# EAGLE design PCB-CMB-5-SKAARDUINO (EAGLE 7.1.0)

## Sheet 1 of 2
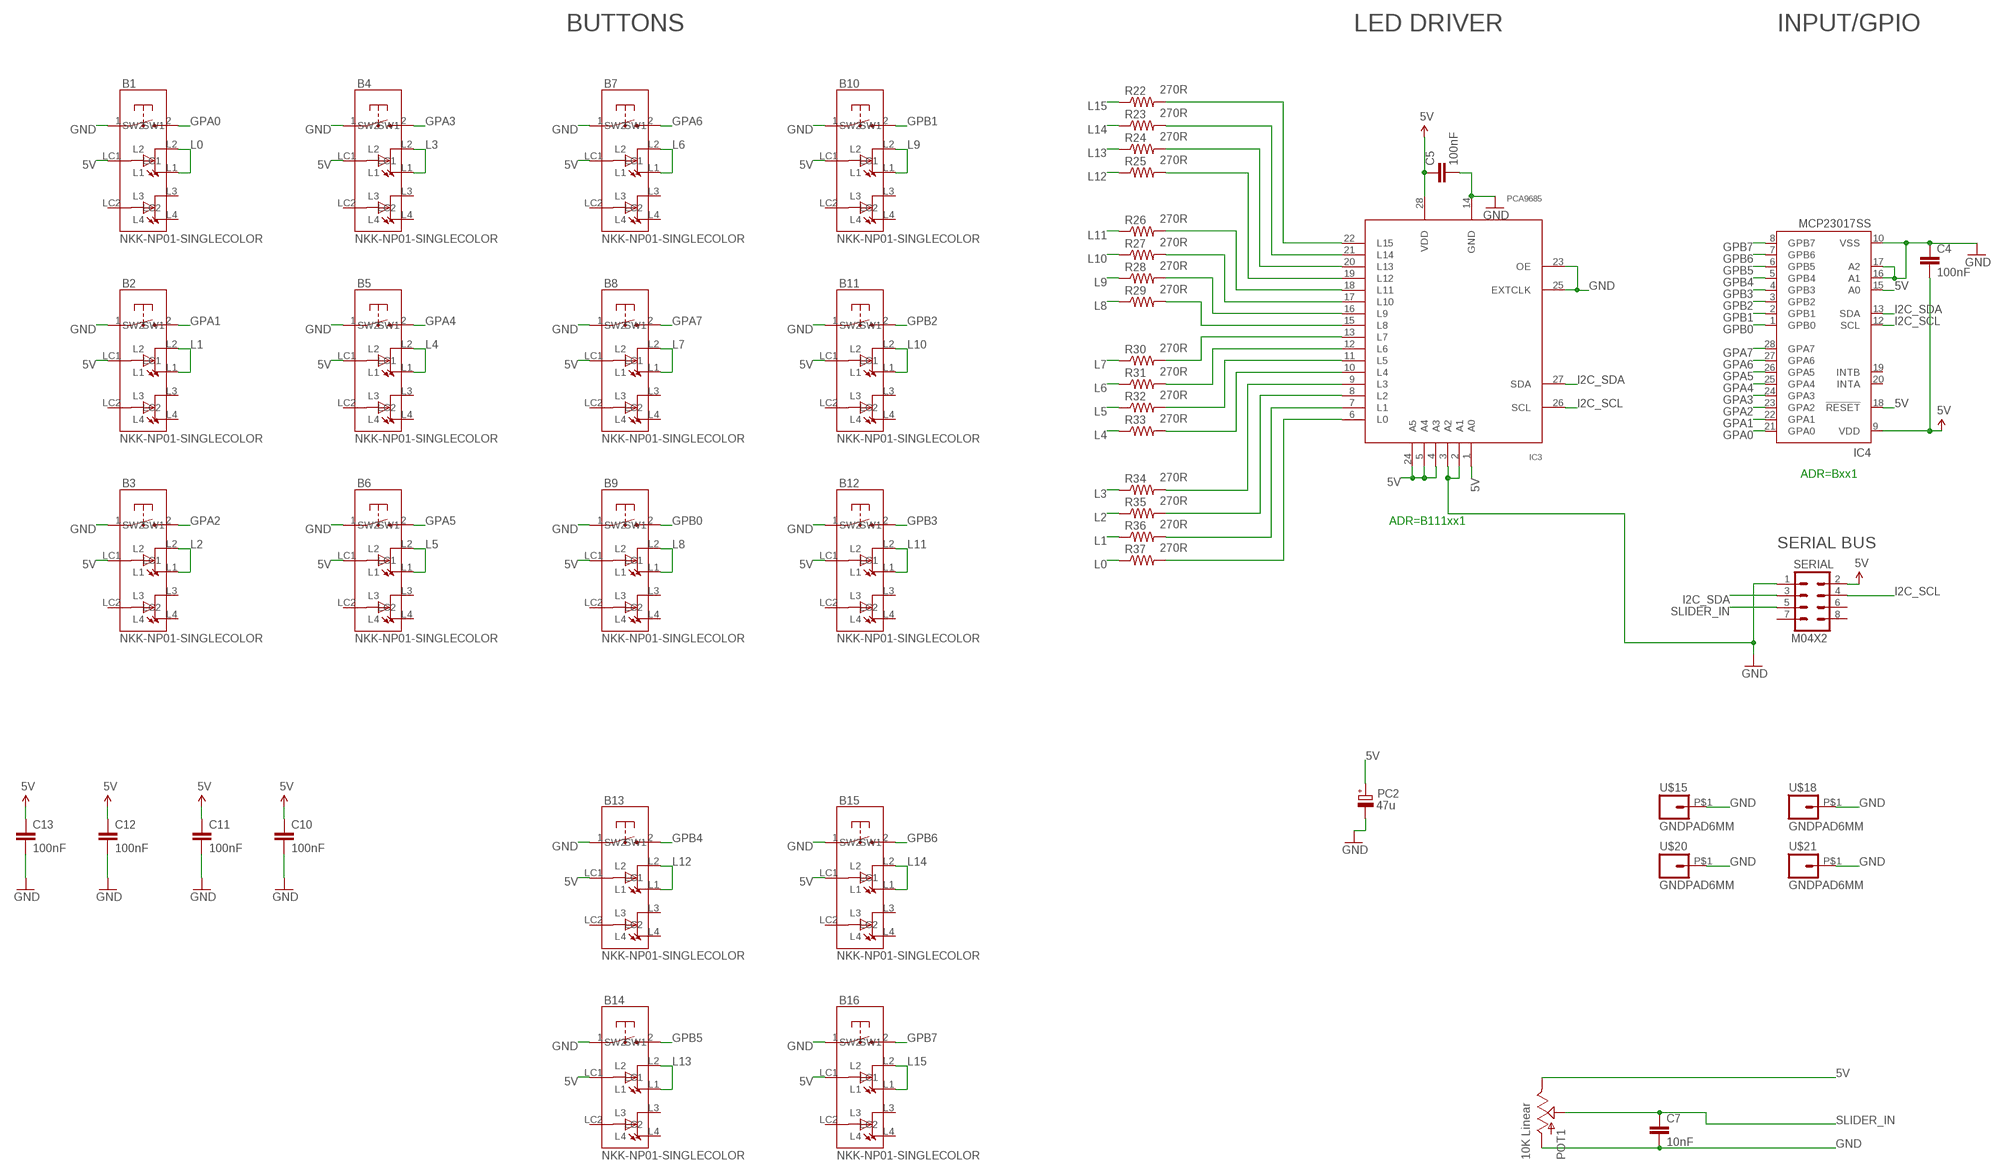
[diagram p0: schematic, sheet 1]

### Parts
B1  NKK-NP01-SINGLECOLOR  [NKK-NP01]
B2  NKK-NP01-SINGLECOLOR  [NKK-NP01]
B3  NKK-NP01-SINGLECOLOR  [NKK-NP01]
B4  NKK-NP01-SINGLECOLOR  [NKK-NP01]
B5  NKK-NP01-SINGLECOLOR  [NKK-NP01]
B6  NKK-NP01-SINGLECOLOR  [NKK-NP01]
B7  NKK-NP01-SINGLECOLOR  [NKK-NP01]
B8  NKK-NP01-SINGLECOLOR  [NKK-NP01]
B9  NKK-NP01-SINGLECOLOR  [NKK-NP01]
B10  NKK-NP01-SINGLECOLOR  [NKK-NP01]
B11  NKK-NP01-SINGLECOLOR  [NKK-NP01]
B12  NKK-NP01-SINGLECOLOR  [NKK-NP01]
B13  NKK-NP01-SINGLECOLOR  [NKK-NP01]
B14  NKK-NP01-SINGLECOLOR  [NKK-NP01]
B15  NKK-NP01-SINGLECOLOR  [NKK-NP01]
B16  NKK-NP01-SINGLECOLOR  [NKK-NP01]
C4  100nF  CAP0603-CAP  [0603-CAP]
C5  100nF  CAP0603-CAP  [0603-CAP]
C7  10nF  CAP0603-CAP  [0603-CAP]
C10  100nF  CAP0603-CAP  [0603-CAP]
C11  100nF  CAP0603-CAP  [0603-CAP]
C12  100nF  CAP0603-CAP  [0603-CAP]
C13  100nF  CAP0603-CAP  [0603-CAP]
IC3  PCA9685  [TSSOP28]
IC4  MCP23017SS  [SSOP28]
PC2  47u  CPOL-EUD  [PANASONIC_D]
POT1  10K Linear  SLIDER20  [SLIDER20]
R22  270R  RESISTOR0603-RES  [0603-RES]
R23  270R  RESISTOR0603-RES  [0603-RES]
R24  270R  RESISTOR0603-RES  [0603-RES]
R25  270R  RESISTOR0603-RES  [0603-RES]
R26  270R  RESISTOR0603-RES  [0603-RES]
R27  270R  RESISTOR0603-RES  [0603-RES]
R28  270R  RESISTOR0603-RES  [0603-RES]
R29  270R  RESISTOR0603-RES  [0603-RES]
R30  270R  RESISTOR0603-RES  [0603-RES]
R31  270R  RESISTOR0603-RES  [0603-RES]
R32  270R  RESISTOR0603-RES  [0603-RES]
R33  270R  RESISTOR0603-RES  [0603-RES]
R34  270R  RESISTOR0603-RES  [0603-RES]
R35  270R  RESISTOR0603-RES  [0603-RES]
R36  270R  RESISTOR0603-RES  [0603-RES]
R37  270R  RESISTOR0603-RES  [0603-RES]
SERIAL  M04X2  [2X4]
U$15  GNDPAD6MM  [3.2MMPAD6MM]
U$18  GNDPAD6MM  [3.2MMPAD6MM]
U$20  GNDPAD6MM  [3.2MMPAD6MM]
U$21  GNDPAD6MM  [3.2MMPAD6MM]

### Nets
5V [Power]: B1.LC1 B2.LC1 B3.LC1 B4.LC1 B5.LC1 B6.LC1 B7.LC1 B8.LC1 B9.LC1 B10.LC1 B11.LC1 B12.LC1 B13.LC1 B14.LC1 B15.LC1 B16.LC1 C4.2 C5.1 C10.1 C11.1 C12.1 C13.1 IC3.1(A0) IC3.4(A3) IC3.5(A4) IC3.24(A5) IC3.28(VDD) IC4.9(VDD) IC4.15(A0) IC4.18(!RESET) PC2.+ POT1.1(E) SERIAL.2
GND [Power]: B1.1(SW1) B2.1(SW1) B3.1(SW1) B4.1(SW1) B5.1(SW1) B6.1(SW1) B7.1(SW1) B8.1(SW1) B9.1(SW1) B10.1(SW1) B11.1(SW1) B12.1(SW1) B13.1(SW1) B14.1(SW1) B15.1(SW1) B16.1(SW1) C4.1 C5.2 C7.2 C10.2 C11.2 C12.2 C13.2 IC3.2(A1) IC3.3(A2) IC3.14(GND) IC3.23(OE) IC3.25(EXTCLK) IC4.10(VSS) IC4.16(A1) IC4.17(A2) PC2.- POT1.3(A) SERIAL.1 U$15.P$1 U$18.P$1 U$20.P$1 U$21.P$1
GPA0: B1.2(SW2) IC4.21(GPA0)
GPA1: B2.2(SW2) IC4.22(GPA1)
GPA2: B3.2(SW2) IC4.23(GPA2)
GPA3: B4.2(SW2) IC4.24(GPA3)
GPA4: B5.2(SW2) IC4.25(GPA4)
GPA5: B6.2(SW2) IC4.26(GPA5)
GPA6: B7.2(SW2) IC4.27(GPA6)
GPA7: B8.2(SW2) IC4.28(GPA7)
GPB0 [Power]: B9.2(SW2) IC4.1(GPB0)
GPB1: B10.2(SW2) IC4.2(GPB1)
GPB2: B11.2(SW2) IC4.3(GPB2)
GPB3: B12.2(SW2) IC4.4(GPB3)
GPB4: B13.2(SW2) IC4.5(GPB4)
GPB5: B14.2(SW2) IC4.6(GPB5)
GPB6: B15.2(SW2) IC4.7(GPB6)
GPB7: B16.2(SW2) IC4.8(GPB7)
I2C_SCL: IC3.26(SCL) IC4.12(SCL) SERIAL.4
I2C_SDA: IC3.27(SDA) IC4.13(SDA) SERIAL.3
L0: B1.L1 B1.L2 R37.1
L1: B2.L1 B2.L2 R36.1
L2: B3.L1 B3.L2 R35.1
L3: B4.L1 B4.L2 R34.1
L4: B5.L1 B5.L2 R33.1
L5: B6.L1 B6.L2 R32.1
L6: B7.L1 B7.L2 R31.1
L7: B8.L1 B8.L2 R30.1
L8: B9.L1 B9.L2 R29.1
L9: B10.L1 B10.L2 R28.1
L10: B11.L1 B11.L2 R27.1
L11: B12.L1 B12.L2 R26.1
L12: B13.L1 B13.L2 R25.1
L13: B14.L1 B14.L2 R24.1
L14: B15.L1 B15.L2 R23.1
L15: B16.L1 B16.L2 R22.1
N$2: IC3.13(L7) R30.2
N$19: IC3.12(L6) R31.2
N$23: IC3.11(L5) R32.2
N$31: IC3.10(L4) R33.2
N$58: IC3.9(L3) R34.2
N$59: IC3.8(L2) R35.2
N$67: IC3.7(L1) R36.2
N$74: IC3.6(L0) R37.2
N$75: IC3.15(L8) R29.2
N$76: IC3.16(L9) R28.2
N$77: IC3.17(L10) R27.2
N$78: IC3.18(L11) R26.2
N$79: IC3.19(L12) R25.2
N$80: IC3.20(L13) R24.2
N$81: IC3.21(L14) R23.2
N$82: IC3.22(L15) R22.2
SLIDER_IN: C7.1 POT1.2A(S) SERIAL.5
Unconnected: B1.L3 B1.L4 B1.LC2 B2.L3 B2.L4 B2.LC2 B3.L3 B3.L4 B3.LC2 B4.L3 B4.L4 B4.LC2 B5.L3 B5.L4 B5.LC2 B6.L3 B6.L4 B6.LC2 B7.L3 B7.L4 B7.LC2 B8.L3 B8.L4 B8.LC2 B9.L3 B9.L4 B9.LC2 B10.L3 B10.L4 B10.LC2 B11.L3 B11.L4 B11.LC2 B12.L3 B12.L4 B12.LC2 B13.L3 B13.L4 B13.LC2 B14.L3 B14.L4 B14.LC2 B15.L3 B15.L4 B15.LC2 B16.L3 B16.L4 B16.LC2 IC4.19(INTB) IC4.20(INTA) SERIAL.6 SERIAL.7 SERIAL.8

### Notes on the sheet
- BUTTONS | LED DRIVER | INPUT/GPIO
- ADR=Bxx1
- ADR=B111xx1
- SERIAL BUS

## Sheet 2 of 2

## Library data of the parts
B1-B16 = SKAARHOJ:NKK-NP01-SINGLECOLOR
C4 C5 C7 C10-C13 = SparkFun:CAP: Capacitor Standard 0603 ceramic capacitor, and 0.1" leaded capacitor.
IC3 = wsmith:PCA9685
IC4 = microchip:MCP23017: http://ww1.microchip.com/downloads/en/DeviceDoc/21952a.pdf Source: http://ww1.microchip.com/downloads/en/DeviceDoc/21952a.pdf; MF: MICROCHIP; MPN: MCP23017-E/SS; OC_FARNELL: 1467674; OC_NEWARK: 31K2960
PC2 = rcl:CPOL-EU: POLARIZED CAPACITOR, European symbol
POT1 = SKAARHOJ:SLIDER
R22-R37 = SparkFun:RESISTOR: Resistor Basic schematic elements and footprints for 0603, 1206, and PTH resistors.
SERIAL = SparkFun:M04X2
U$15 U$18 U$20 U$21 = SKAARHOJ:GNDPAD

## Net classes
0 default: width 0.203 mm, drill 0.305 mm, clearance 0.203 mm
1 Power: width 0.406 mm, drill 0.457 mm, clearance 0.203 mm
2 RELAY LINES: width 0.305 mm, drill 0.305 mm, clearance 0.203 mm
3 INput lines: width 0.203 mm, drill 0.305 mm, clearance 0.203 mm

## Board
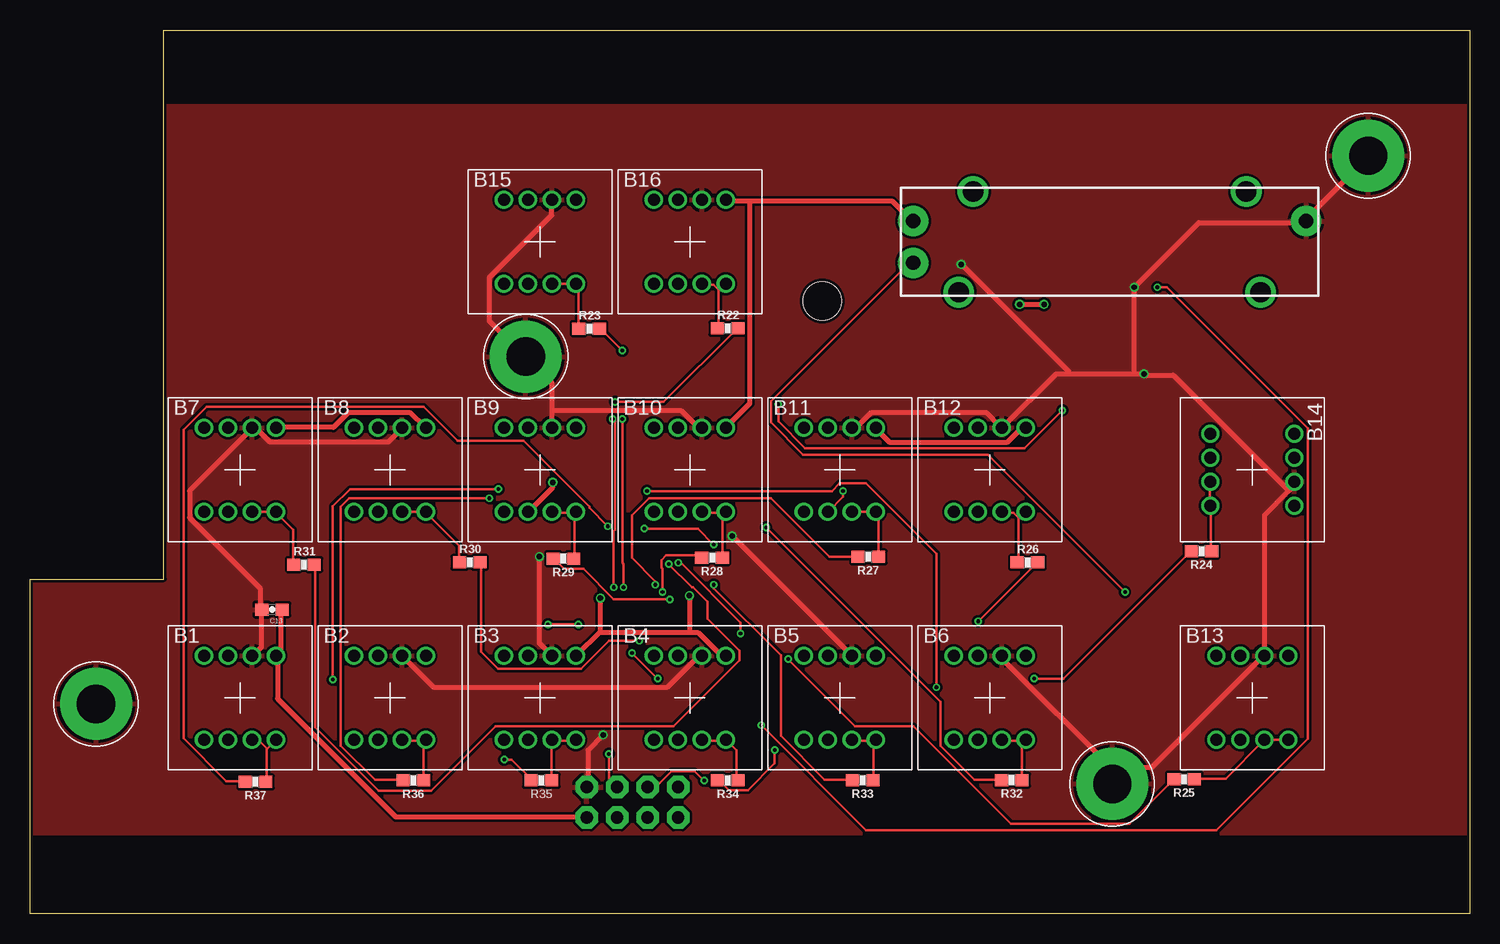
[diagram p1: board, top side]
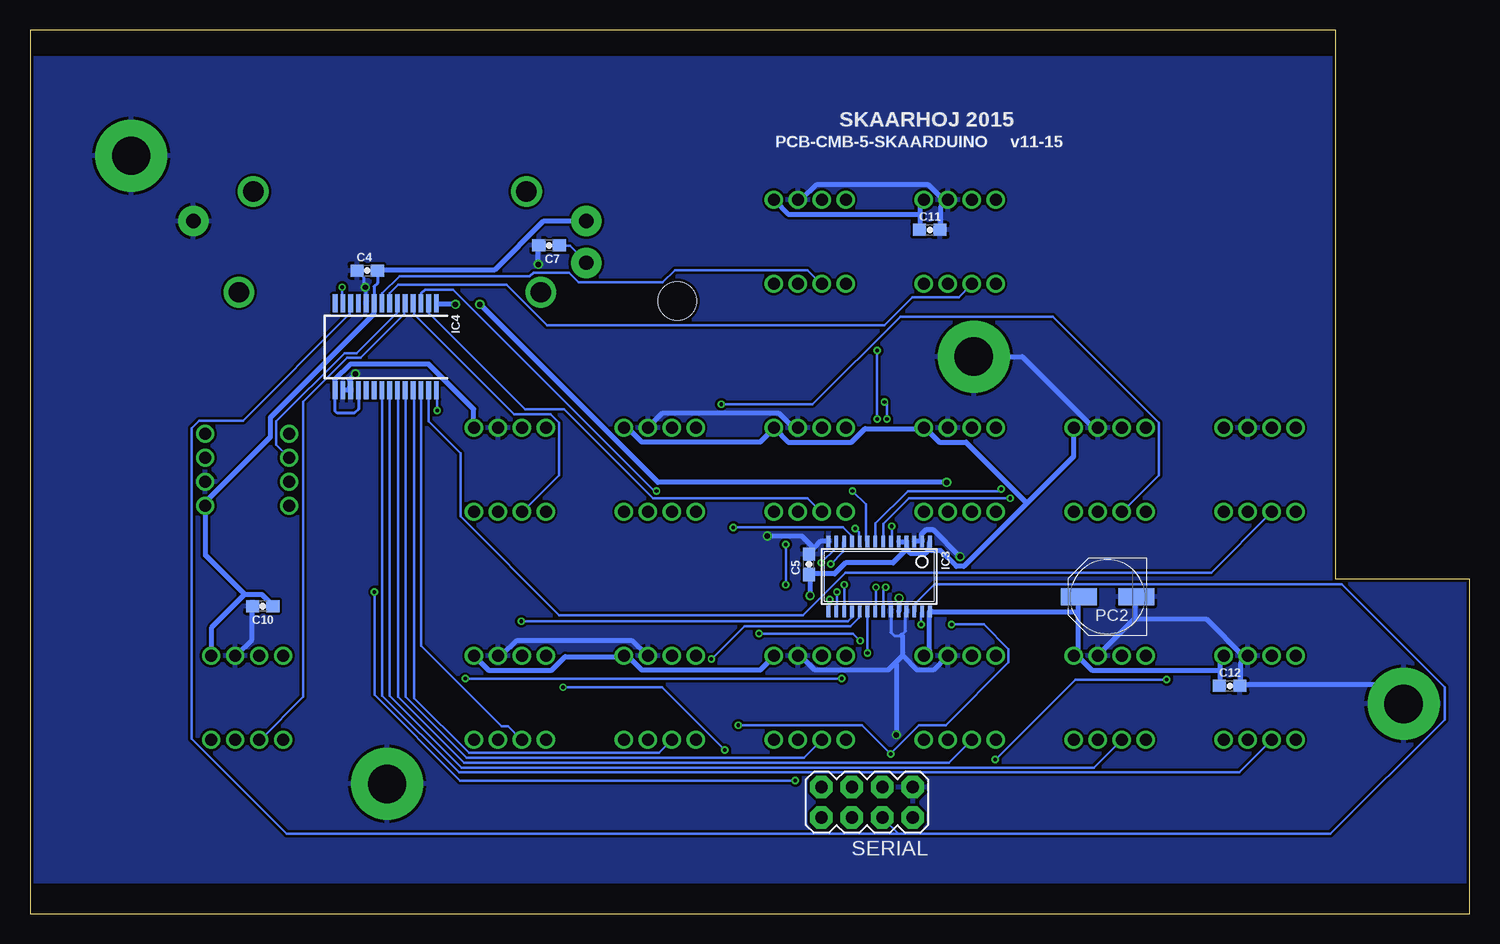
[diagram p2: board, bottom side, seen from below]

Size 120 x 73.66 mm. Coordinates in mm from the lower left corner, seen from the top.
Outline: 0,0 0,27.9 11.16,27.9 11.16,73.66 120,73.66 120,0 0,0
Copper layers (1*16): Top 0.035mm / dielectric 1.5mm / Bottom 0.035mm
Design rules "Fusion_eagle_rule_v1.1": minimum track width 6mil, minimum drill 12mil, track to track 6mil, track to pad 6mil, pad to pad 6mil, via to via 6mil, smd to smd 0mil, copper to edge 10mil, drill to drill 10mil, minimum pad ring 10mil, minimum via ring 6mil, stop-mask expansion 2mil, vias tented up to drill 100mil, thermal gap 10mil
Holes 3.2 mm at 66.04,51.07
tRestrict: area 0,0 to 120,6.5; area 0,67.5 to 120,74
bRestrict: area 0,71.5 to 120,74; area 0,0 to 120,2.5

### Footprints (pad centres in the part's own frame; a part is rotated, then mirrored left to right if it is on the bottom)
NKK-NP01 = drill 1: 1 1,3.5; 2 -1,-3.5; L1 3,-3.5; L2 1,-3.5; L3 -1,3.5; L4 -3,3.5; LC1 3,3.5; LC2 -3,-3.5
0603-CAP = smd 1.1 x 1: 1 -0.85,0; 2 0.85,0
TSSOP28 = smd 0.305 x 0.991: 1 -4.225,-2.918; 2 -3.575,-2.918; 3 -2.925,-2.918; 4 -2.275,-2.918; 5 -1.625,-2.918; 6 -0.975,-2.918; 7 -0.325,-2.918; 8 0.325,-2.918; 9 0.975,-2.918; 10 1.625,-2.918; 11 2.275,-2.918; 12 2.925,-2.918; 13 3.575,-2.918; 14 4.225,-2.918; 15 4.225,2.918; 16 3.575,2.918; 17 2.925,2.918; 18 2.275,2.918; 19 1.625,2.918; 20 0.975,2.918; 21 0.325,2.918; 22 -0.325,2.918; 23 -0.975,2.918; 24 -1.625,2.918; 25 -2.275,2.918; 26 -2.925,2.918; 27 -3.575,2.918; 28 -4.225,2.918
SSOP28 = smd 0.4 x 1.5: 1 -4.225,-3.625; 2 -3.575,-3.625; 3 -2.925,-3.625; 4 -2.275,-3.625; 5 -1.625,-3.625; 6 -0.975,-3.625; 7 -0.325,-3.625; 8 0.325,-3.625; 9 0.975,-3.625; 10 1.625,-3.625; 11 2.275,-3.625; 12 2.925,-3.625; 13 3.575,-3.625; 14 4.225,-3.625; 15 4.225,3.625; 16 3.575,3.625; 17 2.925,3.625; 18 2.275,3.625; 19 1.625,3.625; 20 0.975,3.625; 21 0.325,3.625; 22 -0.325,3.625; 23 -0.975,3.625; 24 -1.625,3.625; 25 -2.275,3.625; 26 -2.925,3.625; 27 -3.575,3.625; 28 -4.225,3.625
PANASONIC_D = smd 3 x 1.4: + 2.4,0; - -2.4,0
SLIDER20 = drill 1.194 pad 2.54: 1 -16.383,1.74; 2A -16.383,-1.74; 3 16.383,1.74 | drill 1.702: P$1 -11.392,4.191; P$2 11.392,4.191; P$3 12.598,-4.191; P$4 -12.598,-4.191
0603-RES = smd 1.1 x 1: 1 -0.85,0; 2 0.85,0
2X4 = drill 1.016 pad 1.88 octagon: 1 -3.81,-1.27; 2 -3.81,1.27; 3 -1.27,-1.27; 4 -1.27,1.27; 5 1.27,-1.27; 6 1.27,1.27; 7 3.81,-1.27; 8 3.81,1.27
3.2MMPAD6MM = drill 3.2 pad 6: P$1 0,0

### Placement (x,y rotation side)
B1  17.5,18 0 top
B2  30,18 0 top
B3  42.5,18 0 top
B4  55,18 0 top
B5  67.5,18 0 top
B6  80,18 0 top
B7  17.5,37 0 top
B8  30,37 0 top
B9  42.5,37 0 top
B10  55,37 0 top
B11  67.5,37 0 top
B12  80,37 0 top
B13  101.88,18 0 top
B14  101.88,37 270 top
B15  42.5,56 0 top
B16  55,56 0 top
C4  91.89,53.62 0 bottom
C5  55.07,29.13 90 bottom
C7  76.73,55.71 180 bottom
C10  100.6,25.64 180 bottom
C11  45,57 0 bottom
C12  20,19 0 bottom
C13  20.18,25.36 180 top
IC3  49.21,28.12 180 bottom
IC4  90.35,47.26 180 bottom
PC2  30.18,26.42 180 bottom
POT1  90,56 0 top
R22  58.16,48.8 0 top
R23  46.61,48.77 0 top
R24  97.65,30.23 180 top
R25  96.22,11.23 180 top
R26  83.15,29.29 0 top
R27  69.88,29.75 180 top
R28  56.86,29.68 180 top
R29  44.47,29.61 180 top
R30  36.66,29.3 0 top
R31  22.84,29.11 0 top
R32  81.84,11.16 180 top
R33  69.41,11.14 180 top
R34  58.17,11.12 180 top
R35  42.62,11.12 180 top
R36  31.96,11.12 180 top
R37  18.81,11 180 top
SERIAL  50.22,9.3 180 bottom
U$15  90.23,10.84 0 top
U$18  111.56,63.18 0 top
U$20  5.5,17.5 0 top
U$21  41.32,46.44 0 top

### Tracks (layer width: path | path; a pad name or v marks a point on that pad's centre or on a via)
5V  (via drill 0.46)
  Top 0.406: C13.1 20.93,25.3 20.93,21.95 20.52,21.54 B1.LC1 20.64,21.43 20.64,17.94 30.48,8.1 46.35,8.1 SERIAL.2 | 47.55,23.57 v47.55,26.31 | 47.55,23.57 45.52,21.54 B3.LC1 | 54.97,23.47 47.65,23.47 47.55,23.57 | 54.97,23.47 55.68,23.47 57.61,21.54 57.91,21.54 B4.LC1 | B7.LC1 20.52,40.54 25.3,40.54 26.52,41.76 31.7,41.76 32.92,40.54 B8.LC1 | B12.LC1 82.91,40.44 82.6,40.44 81.48,39.32 71.63,39.32 70.51,40.44 B11.LC1 | v54.97,26.52 54.97,23.47 | 60.01,59.37 71.91,59.37 73.5,57.78 POT1.1 | 60.01,59.37 58.1,59.37 B16.LC1 | 60.01,59.37 60.01,42.55 58.1,40.64 B10.LC1
  Bottom 0.254: C4.2 91.04,52.57 91.31,52.3 91.31,50.9 IC4.9 | IC4.18 92.62,42.07 92.96,41.73 94.39,41.73 94.56,41.91 IC4.15
  Bottom 0.406: 20.83,20.32 20.83,21.13 20.52,21.44 B1.LC1 | 20.83,20.32 20.83,19.1 C12.1 | 32.61,25.2 32.61,21.84 32.92,21.54 B2.LC1 32.72,21.54 31.5,20.32 20.83,20.32 | 32.61,25.2 32.61,26.42 PC2.+ | B6.LC1 82.91,21.44 81.79,20.32 76.5,20.32 75.39,21.44 70.51,21.44 B5.LC1 70.31,21.44 70.1,21.44 68.99,20.32 59.13,20.32 58.01,21.44 B4.LC1 | B3.LC1 45.41,21.54 45.01,21.95 45.01,25.2 IC3.28 44.81,25.2 32.61,25.2 | v47.55,26.31 47.55,25.3 IC3.24 | 45.01,30.38 45.01,30.99 IC3.1 | 45.01,30.38 45.31,30.07 46.63,30.07 46.94,30.38 | 46.94,30.99 46.94,30.38 | 46.94,30.99 IC3.4 | 46.94,30.99 47.55,30.99 IC3.5 | 46.94,30.38 48.06,29.26 52.02,29.26 52.93,28.35 55.07,28.35 C5.1 54.97,28.14 v54.97,26.52 | 36.88,34.24 33.02,38.1 33.02,40.44 B8.LC1 | 36.88,34.24 42.16,28.96 42.77,28.96 44.09,30.28 44.91,30.28 45.01,30.38 | IC4.15 94.59,43.69 94.59,44.5 93.27,45.82 86.77,45.82 83.01,42.06 83.01,40.54 B12.LC1 | B11.LC1 70.41,40.44 70.1,40.44 68.99,39.32 59.13,39.32 58.12,40.34 B10.LC1 57.91,40.44 56.79,39.32 51.51,39.32 50.39,40.44 45.52,40.44 B9.LC1 45.31,40.44 44.2,39.32 41.96,39.32 36.88,34.24 | 45.82,58.32 45.82,59.13 45.52,59.44 B15.LC1 | 45.82,58.32 45.82,57.1 C11.1 | 45.82,58.32 56.79,58.32 57.91,59.44 B16.LC1 | 102.11,26.62 100.69,26.62 99.77,25.7 C10.1 | 102.11,26.62 104.85,23.88 104.85,21.54 B13.LC1 | 102.11,26.62 105.36,29.87 105.36,33.93 B14.LC1 105.26,34.14 105.26,34.44 99.97,39.73 99.97,41.35 91.34,49.99 91.34,50.8 IC4.9 | C4.2 90.93,53.65 81.28,53.65 77.22,57.71 73.66,57.71 POT1.1
GND  (via drill 0.46)
  Top 0.406: v42.47,29.77 42.47,22.55 43.48,21.54 B3.1 | B1.1 18.59,21.54 19.3,22.25 19.3,25.3 C13.2 19.2,25.5 19.2,27.13 13.31,33.02 13.31,35.26 18.39,40.34 B7.1 18.59,40.44 18.9,40.44 20.02,39.32 29.87,39.32 30.99,40.44 B8.1 | B4.1 55.98,21.44 55.68,21.44 53.14,18.9 33.63,18.9 31.09,21.44 B2.1 | 43.48,41.96 43.48,44.3 41.35,46.43 U$21.P$1 41.15,46.53 38.3,49.38 38.3,53.03 43.48,58.22 43.48,59.44 B15.1 | 43.48,41.96 43.48,40.54 B9.1 | 43.48,41.96 54.25,41.96 55.68,40.54 55.98,40.54 B10.1 | v58.52,31.5 68.48,21.54 B5.1 | B6.1 81.08,21.44 81.08,21.23 90.22,12.09 90.22,10.87 U$15.P$1 90.32,12.19 93.47,12.19 102.72,21.44 B13.1 102.92,21.54 102.92,33.22 104.95,35.26 | U$18.P$1 111.56,63.09 106.48,58.01 106.48,57.81 POT1.3 106.27,57.61 97.43,57.61 v92.05,52.22 92.05,45.01 | 104.95,35.26 105.36,35.66 105.36,35.97 B14.1 | 86.68,45.01 85.55,45.01 81.08,40.54 B12.1 80.87,40.64 79.76,41.76 70.1,41.76 68.89,40.54 68.58,40.54 B11.1 | 86.68,45.01 92.05,45.01 | 92.05,45.01 v92.86,45.01 92.96,44.91 95.3,44.91 104.95,35.26 | v77.63,54.13 86.68,45.09 86.68,45.01 | v47.78,14.92 46.51,13.65 46.51,10.64 SERIAL.1
  Bottom 0.254: IC4.10 91.97,52.22 91.97,52.4 92.15,52.58 92.15,53.03 C4.1 | IC3.23 48.23,23.47 47.95,23.19 47.4,23.19 47.33,23.25 47.02,23.57 47.02,25.12 IC3.25
  Bottom 0.406: IC3.3 46.23,31.09 45.72,31.09 IC3.2 45.72,31.29 45.72,31.6 45.31,32 44.7,32 v42.47,29.77 | 47.24,21.54 47.24,23.16 47.33,23.25 | 47.24,21.54 46.02,20.32 44.7,20.32 43.59,21.44 B3.1 | 47.24,21.54 47.88,20.9 | 47.88,20.9 48.46,20.32 54.56,20.32 55.68,21.44 55.98,21.44 B4.1 | 27.84,24.69 27.84,26.42 PC2.- | 27.84,24.69 30.99,21.54 B2.1 | 27.84,24.69 27.74,24.59 21.95,24.59 18.8,21.44 B1.1 18.59,21.44 19.1,20.93 19.1,19.1 C12.2 18.9,19.1 7.11,19.1 5.59,17.58 U$20.P$1 | C11.2 44.09,57.1 44.09,58.93 43.59,59.44 B15.1 43.79,59.44 45.11,60.76 54.46,60.76 55.68,59.54 55.98,59.54 B16.1 | B8.1 31.09,40.54 31.39,40.54 37.29,46.43 41.25,46.43 U$21.P$1 | IC3.14 53.44,31.09 54.05,31.09 54.66,30.48 | 54.66,30.48 55.07,30.07 C5.2 | 54.66,30.48 55.68,31.5 v58.52,31.5 | B6.1 80.97,21.54 80.67,21.54 79.45,22.76 69.8,22.76 68.58,21.54 B5.1 | C10.2 101.5,25.6 101.5,22.86 102.82,21.54 B13.1 | IC4.16 93.88,43.69 93.37,43.69 IC4.17 93.37,43.89 93.37,44.5 v92.86,45.01 | v92.05,52.22 91.97,52.22 | B10.1 56.08,40.54 56.39,40.54 57.61,41.76 67.26,41.76 68.48,40.54 B11.1 | v77.63,54.13 77.63,55.56 C7.2 | v47.78,14.92 47.78,20.8 47.88,20.9
  pour Top: 0,0 120.28,0 120.28,74.4 0,74.4
  pour Bottom: 0,0 120.28,0 120.28,74.4 0,74.4
GPA0
  Bottom 0.203: IC4.21 90.63,43.59 90.63,18.19 84.23,11.79 19.2,11.79 16.56,14.43 B1.2
GPA1
  Bottom 0.203: IC4.22 90.02,43.59 90.02,18.19 84.02,12.19 31.29,12.19 29.06,14.43 B2.2
GPA2
  Bottom 0.203: IC4.23 89.31,43.59 89.31,18.09 83.82,12.6 43.38,12.6 41.55,14.43 B3.2
GPA3
  Bottom 0.203: IC4.24 88.7,43.59 88.7,18.09 83.62,13.01 55.47,13.01 54.05,14.43 B4.2
GPA4
  Bottom 0.203: IC4.25 87.99,43.59 87.99,17.98 83.41,13.41 67.56,13.41 66.55,14.43 B5.2
GPA5
  Bottom 0.203: IC4.26 87.38,43.59 87.38,22.35 80.67,15.65 80.16,15.65 79.05,14.53 B6.2
GPA6
  Bottom 0.203: IC4.27 86.77,43.59 86.77,41.05 84.12,38.41 84.12,33.12 75.89,24.89 55.58,24.89 52.02,28.45 21.54,28.45 16.56,33.43 B7.2
GPA7  (via drill 0.3)
  Top 0.203: v86.06,41.96 82.91,38.81 64.62,38.81 62.38,41.05 v62.38,42.47
  Bottom 0.203: v86.06,41.96 86.06,43.59 IC4.28 | v62.38,42.47 54.76,42.47 47.45,49.78 34.75,49.78 25.91,40.95 25.91,36.58 28.96,33.53 B8.2
GPB0  (via drill 0.46)
  Top 0.406: v82.5,50.8 v84.53,50.8 | v43.59,35.97 43.59,35.56 41.55,33.53 B9.2
  Bottom 0.406: v84.53,50.8 86.06,50.8 IC4.1 | v82.5,50.8 67.67,35.97 v43.59,35.97
GPB1
  Bottom 0.203: IC4.2 86.77,50.8 86.77,50.09 78.74,42.06 75.49,42.06 68.07,34.65 55.17,34.65 54.05,33.53 B10.2
GPB2  (via drill 0.3)
  Top 0.203: v67.77,35.26 67.77,34.75 66.55,33.53 B11.2
  Bottom 0.203: v67.77,35.26 67.97,35.26 84.73,52.02 87.07,52.02 87.38,51.71 87.38,50.9 IC4.3
GPB3
  Bottom 0.203: IC4.4 87.99,50.8 87.99,49.99 79.65,41.66 76.61,41.66 75.89,40.95 75.89,36.58 78.94,33.53 B12.2
GPB4
  Bottom 0.203: IC4.5 88.8,50.8 88.8,49.99 92.46,46.33 93.57,46.33 97.23,42.67 97.23,18.09 100.79,14.53 B13.2
GPB5
  Bottom 0.203: IC4.6 89.41,50.8 89.41,50.09 92.76,46.74 93.78,46.74 99.47,41.05 99.47,39.12 98.45,38.1 B14.2
GPB6
  Bottom 0.203: IC4.7 90.02,50.9 90.02,51.71 89.31,52.43 80.26,52.43 76.91,49.07 48.77,49.07 46.43,51.41 42.57,51.41 41.55,52.43 B15.2
GPB7
  Bottom 0.203: IC4.8 90.63,50.9 90.63,51.71 89.2,53.14 78.33,53.14 78.03,53.44 75.08,53.44 74.27,52.63 67.26,52.63 66.24,53.65 55.17,53.65 54.05,52.53 B16.2
I2C_SCL
  Bottom 0.203: 47.62,6.67 11.59,6.67 2.06,16.19 2.06,18.89 10.64,27.46 44.61,27.46 46.2,25.88 46.2,25.24 IC3.26 | 47.62,6.67 48.9,7.94 SERIAL.4 | 47.62,6.67 98.58,6.67 106.52,14.61 106.52,40.48 105.89,41.12 102.23,41.12 93.34,50.01 93.34,50.8 IC4.12
I2C_SDA  (via drill 0.3)
  Top 0.203: v43.18,24.13 v45.72,24.13 | v48.26,13.34 48.26,11.27 48.9,10.64 SERIAL.3 | v93.98,52.23 94.77,52.23 106.52,40.48 106.52,14.61 98.9,6.99 69.69,6.99 v60.96,15.72
  Bottom 0.203: v45.72,24.13 45.72,25.08 IC3.27 | v43.18,24.13 40.48,24.13 38.42,22.07 38.42,20.95 43.66,15.72 45.88,15.72 v48.26,13.34 50.64,15.72 v60.96,15.72 | v93.98,52.23 93.98,50.96 IC4.13
L0
  Top 0.203: 19.76,13.77 20.42,14.43 B1.L1 | 19.76,13.77 19.71,13.72 19.71,11.07 R37.1 | 19.76,13.77 19.1,14.43 18.59,14.43 B1.L2
L1
  Top 0.203: R36.1 32.82,11.18 32.82,14.33 32.92,14.43 B2.L1 32.82,14.43 31.09,14.43 B2.L2
L2
  Top 0.203: B3.L1 45.31,14.43 43.59,14.43 B3.L2 43.5,14.45 43.5,11.27 R35.1
L3
  Top 0.203: B4.L2 56.08,14.43 57.81,14.43 B4.L1 58.1,14.45 58.9,13.65 58.9,11.27 R34.1
L4
  Top 0.203: R33.1 70.31,11.18 70.31,14.33 70.41,14.43 B5.L1 70.31,14.43 68.58,14.43 B5.L2
L5
  Top 0.203: R32.1 82.7,11.18 82.7,14.22 82.91,14.43 B6.L1 82.8,14.43 81.08,14.43 B6.L2
L6
  Top 0.203: R31.1 21.95,29.16 21.95,32 20.52,33.43 B7.L1 20.42,33.53 18.59,33.53 B7.L2
L7
  Top 0.203: R30.1 35.76,29.36 35.76,30.68 33.02,33.43 B8.L1 32.92,33.53 31.09,33.53 B8.L2
L8
  Top 0.203: R29.1 45.41,29.67 45.41,33.43 B9.L1 45.31,33.43 43.59,33.43 B9.L2
L9
  Top 0.203: R28.1 57.71,29.77 57.71,33.22 57.91,33.43 B10.L1 57.81,33.43 56.08,33.43 B10.L2
L10
  Top 0.203: R27.1 70.71,29.77 70.71,33.22 70.51,33.43 B11.L1 70.41,33.53 68.58,33.53 B11.L2
L11
  Top 0.203: 82.45,32.97 82.91,33.43 B12.L1 | 82.45,32.97 82.4,32.92 82.4,29.36 R26.1 | 82.45,32.97 81.99,33.43 81.08,33.43 B12.L2
L12
  Top 0.203: R25.1 97.13,11.28 99.67,11.28 102.82,14.43 B13.L2 102.92,14.53 104.85,14.53 B13.L1
L13
  Top 0.203: R24.1 98.45,30.28 98.45,33.93 B14.L1 98.35,34.04 98.35,35.97 B14.L2
L14
  Top 0.203: R23.1 45.72,48.87 45.72,52.22 45.52,52.43 B15.L1 45.41,52.53 43.59,52.53 B15.L2
L15
  Top 0.203: 57.45,51.97 57.91,52.43 B16.L1 | 57.45,51.97 57.4,51.92 57.4,48.87 R22.1 | 57.45,51.97 57,52.43 56.08,52.43 B16.L2
N$2  (via drill 0.3)
  Top 0.203: v54.05,29.26 54.25,29.26 59.23,24.28 v59.23,23.37 | v50.8,22.76 48.26,22.76 45.92,20.42 39.01,20.42 37.59,21.84 37.59,29.26 R30.2
  Bottom 0.203: v54.05,29.26 52.83,30.48 52.83,30.99 IC3.13 | v59.23,23.37 51.41,23.37 v50.8,22.76
N$19  (via drill 0.3)
  Top 0.203: v53.24,29.16 55.17,27.23 55.27,27.23 56.49,26.01 56.49,24.59 59.13,21.95 59.13,21.13 53.65,15.65 38.81,15.65 33.43,10.26 29.06,10.26 23.77,15.54 23.77,29.06 R31.2
  Bottom 0.203: v53.24,29.16 52.22,30.18 52.22,30.99 IC3.12
N$23  (via drill 0.3)
  Top 0.203: v61.37,32.21 75.89,17.68 75.89,14.02 78.74,11.18 80.97,11.18 R32.2
  Bottom 0.203: v61.37,32.21 52.22,32.21 51.51,31.5 51.51,31.09 IC3.11
N$31  (via drill 0.3)
  Top 0.203: v51.21,32.11 55.68,32.11 v57,30.79 | v57,27.43 57,27.13 62.59,21.54 62.59,14.83 66.24,11.18 68.48,11.18 R33.2
  Bottom 0.203: v51.21,32.11 50.9,31.8 50.9,31.09 IC3.10 | v57,27.43 v57,30.79
N$58  (via drill 0.3)
  Top 0.203: v51.44,35.24 66.83,35.24 67.47,35.88 69.69,35.88 75.56,30 v75.56,18.89 | v62.07,13.65 62.07,12.54 59.85,10.32 58.26,10.32 57.47,11.11 R34.2
  Bottom 0.203: v51.44,35.24 50.32,34.13 50.32,31.11 IC3.9 | v75.56,18.89 67.31,18.89 v62.07,13.65
N$59  (via drill 0.3)
  Top 0.203: v39.05,35.4 26.67,35.4 25.24,33.97 v25.24,19.53 | v39.53,12.86 40.16,12.86 41.75,11.27 R35.2
  Bottom 0.203: v39.05,35.4 39.21,35.24 46.83,35.24 49.53,32.54 49.53,31.11 IC3.8 | v25.24,19.53 32.86,19.53 v39.53,12.86
N$67  (via drill 0.3)
  Top 0.203: v38.3,34.65 26.62,34.65 25.91,33.93 25.91,14.02 28.75,11.18 31.09,11.18 R36.2
  Bottom 0.203: v38.3,34.65 46.74,34.65 48.87,32.51 48.87,31.09 IC3.7
N$74  (via drill 0.3)
  Top 0.203: v48.16,32.31 46.63,33.83 46.63,33.93 41.15,39.42 35.66,39.42 32.82,42.27 14.73,42.27 12.8,40.34 12.8,14.63 16.36,11.07 17.88,11.07 R37.2
  Bottom 0.203: v48.16,32.31 48.16,31.09 IC3.6
N$75  (via drill 0.3)
  Top 0.203: v53.34,26.21 48.67,26.21 46.13,28.75 44.5,28.75 43.69,29.57 R29.2
  Bottom 0.203: v53.34,26.21 53.34,25.3 IC3.15
N$76  (via drill 0.3)
  Top 0.203: v52.73,26.82 52.73,28.75 52.63,28.85 52.63,29.46 53.03,29.87 55.88,29.87 55.98,29.77 R28.2
  Bottom 0.203: v52.73,26.82 52.73,25.3 IC3.16
N$77  (via drill 0.3)
  Top 0.203: v52.12,27.43 52.12,27.74 50.19,29.67 50.19,33.22 51.61,34.65 61.77,34.65 66.65,29.77 68.99,29.77 R27.2
  Bottom 0.203: v52.12,27.43 52.12,25.3 IC3.17
N$78  (via drill 0.3)
  Top 0.203: v79.05,24.38 83.92,29.26 R26.2
  Bottom 0.203: v79.05,24.38 51.82,24.38 51.51,24.69 51.51,25.2 IC3.18
N$79  (via drill 0.3)
  Top 0.203: v63.2,21.23 68.78,15.65 73.66,15.65 81.79,7.52 91.64,7.52 95.3,11.18 R25.2
  Bottom 0.203: v63.2,21.23 60.45,23.98 51.61,23.98 50.9,24.69 50.9,25.2 IC3.19
N$80  (via drill 0.3)
  Top 0.203: v52.32,19.61 v50.19,21.74 | v83.72,19.61 86.16,19.61 96.72,30.18 R24.2
  Bottom 0.203: v50.19,21.74 IC3.20 | v83.72,19.61 v52.32,19.61
N$81  (via drill 0.3)
  Top 0.203: v49.48,27.23 49.48,29.16 49.38,29.26 v49.38,41.25 | v49.38,46.94 47.55,48.77 R23.2
  Bottom 0.203: v49.48,27.23 49.48,25.3 IC3.21 | v49.38,46.94 v49.38,41.25
N$82  (via drill 0.3)
  Top 0.203: v48.67,27.23 48.67,31.9 48.77,32 48.77,41.05 v48.56,41.25 | v48.77,42.67 52.83,42.67 58.93,48.77 R22.2
  Bottom 0.203: v48.67,27.23 48.87,27.03 48.87,25.3 IC3.22 | v48.56,41.25 48.56,42.47 v48.77,42.67
SLIDER_IN  (via drill 0.3)
  Top 0.203: v56.2,11.11 55.4,11.91 53.5,11.91 52.23,10.64 51.59,10.64 SERIAL.5 | v91.28,26.83 79.85,38.26 64.45,38.26 61.75,40.96 61.75,42.7 73.18,54.13 73.5,54.13 POT1.2A
  Bottom 0.203: C7.1 75.79,55.68 74.98,55.68 73.66,54.36 POT1.2A | v56.2,11.11 84.14,11.11 91.28,18.26 v91.28,26.83

### Text on the board
_bsilk: SKAARHOJ 2015 | v11-15 | PCB-CMB-5-SKAARDUINO